# Altium schematic sheet Schematic.SchDoc
size A4
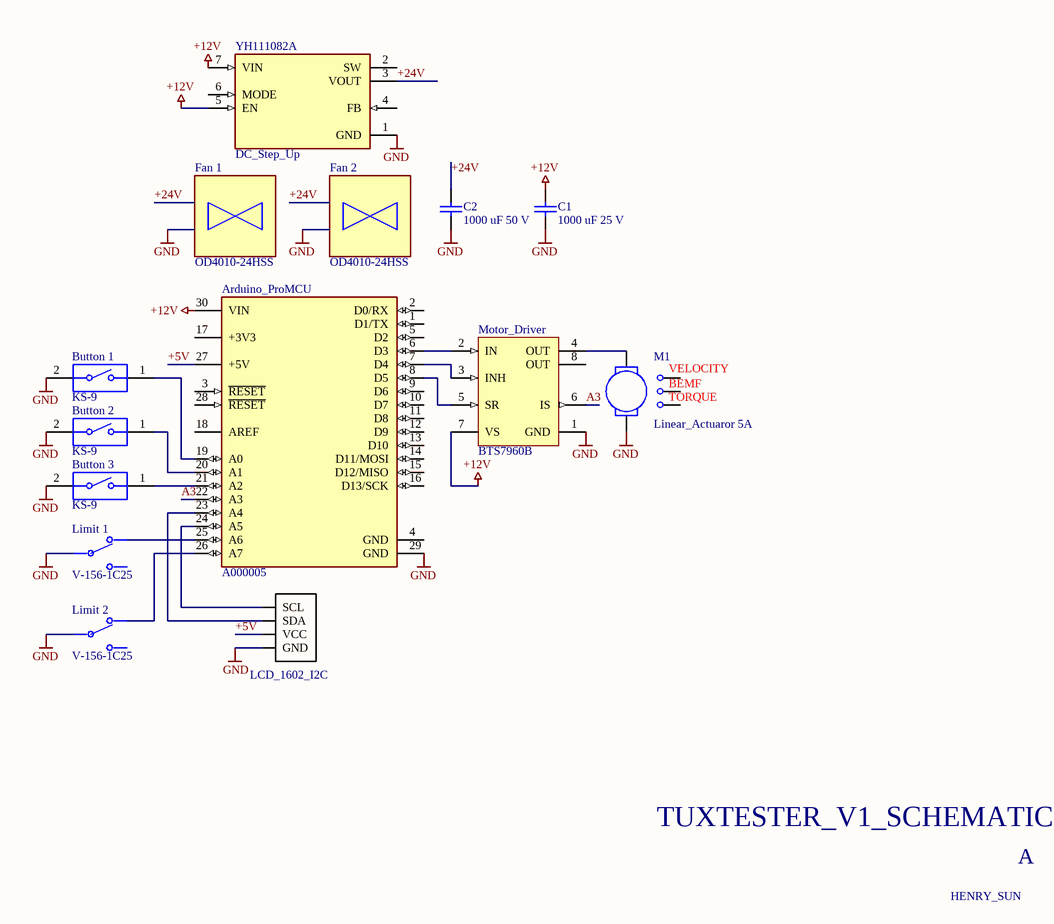
[diagram p0: Schematic.SchDoc]

## Parts
Arduino_ProMCU  A000005  [FP-A000005-MFG]
Button_1  KS-9  [CHRY-MX1A-11NN_V]
Button_2  KS-9  [CHRY-MX1A-11NN_V]
Button_3  KS-9  [CHRY-MX1A-11NN_V]
C1  value 1000 uF 25 V  (hidden comment: Capacitor)
C2  value 1000 uF 50 V  (hidden comment: Capacitor)
DC_Step_Up  YH111082A  [CONV_TPS61022RWUT]
Fan_1  OD4010-24HSS  [FP-PFB1224UHE-MFG]
Fan_2  OD4010-24HSS  [FP-PFB1224UHE-MFG]
LCD_1602_I2C  LCD1602  [LCD1602_I2CLCD1602_LCD1602(Primary)]  (value not drawn)
Limit_1  V-156-1C25  [FP-V-155-1A5-MFG]
Limit_2  V-156-1C25  [FP-V-155-1A5-MFG]
M1  Linear_Actuaror 5A
Motor_Driver  BTS7960B  [INF-P-TO-263-7-6_M]

## Nets
 GND: Arduino_ProMCU.29(GND) Button_1.2 Button_2.2 Button_3.2 C1.2 C2.2 DC_Step_Up.1(GND) LCD_1602_I2C.P$1(GND) M1.2 Motor_Driver.1(GND)  [also labelled GND]
+12V: Arduino_ProMCU.30(VIN) C1.1 DC_Step_Up.5(EN) DC_Step_Up.7(VIN) Motor_Driver.7(VS)
+5V: Arduino_ProMCU.27(+5V) LCD_1602_I2C.P$2(VCC)
+24V: C2.1 DC_Step_Up.3(VOUT)
A3: Arduino_ProMCU.22(A3) Motor_Driver.6(IS)
NetArduino_ProMCU_6: Arduino_ProMCU.6(D3) Motor_Driver.2(IN)
NetArduino_ProMCU_7: Arduino_ProMCU.7(D4) Motor_Driver.3(INH)
NetArduino_ProMCU_8: Arduino_ProMCU.8(D5) Motor_Driver.5(SR)
NetArduino_ProMCU_19: Arduino_ProMCU.19(A0) Button_1.1
NetArduino_ProMCU_20: Arduino_ProMCU.20(A1) Button_2.1
NetArduino_ProMCU_21: Arduino_ProMCU.21(A2) Button_3.1
NetArduino_ProMCU_23: Arduino_ProMCU.23(A4) LCD_1602_I2C.P$3(SDA)
NetArduino_ProMCU_24: Arduino_ProMCU.24(A5) LCD_1602_I2C.P$4(SCL)
NetM1_1: M1.1 Motor_Driver.4(OUT)

Not connected (* = marked no-connect by the designer): Arduino_ProMCU 1(D1/TX) 2(D0/RX) 3(~{RESET}) 4(GND) 5(D2) 9(D6) 10(D7) 11(D8) 12(D9) 13(D10) 14(D11/MOSI) 15(D12/MISO) 16(D13/SCK) 17(+3V3) 18(AREF) 25(A6) 26(A7) 28(~{RESET}); DC_Step_Up 2(SW) 4(FB) 6(MODE); M1 3 4 5; Motor_Driver 8(OUT)

## Notes on the sheet
- TUXTESTER_V1_SCHEMATIC
- A
- HENRY_SUN
- (in symbol DC Motor) VELOCITY; BEMF; TORQUE

## Library data of the parts
Arduino_ProMCU = CMP-189986-000002-1: ARDUINO NANO ATMEGA328 EVAL BRD; Number of Bits: 8; Evaluation Kit: Yes; Operating Supply Voltage: 12V; Interface: I2C; Data Bus Width: 8b; Core Architecture: AVR; Packaging: Bulk; Length: 7inch; Package Quantity: 50; Width: 5inch; REACH SVHC: No SVHC; Weight: 0.358383oz; Series: AVR® ATmega; Height: 0.25inch
Button_1-Button_3 = CMP-2000-06785-1: Keymodule MX, SPST, IP40, 12 V Max, 10 mA Max, -10 to 70 degC, 2-Pin THD, RoHS, Bulk; Part No: MX1A11NN; Manufacturer: Cherry; Body Orientation: Straight; Total Travel: 4.06mm; Actuator Style: Button; Minimum Insulation Resistance: 100MOhm; Maximum Current Rating: 0.01A; Maximum Contact Resistance: 200mOhm; Operating Force: 0.58N; Actuator Length: 3.6mm; Maximum DC Voltage Rating: 12V; Illumination Type: N/R; Row Spacing: 6.35mm; Switch Configuration: N.O.; Electrical Life: 50000000Cycles; Type: DesktopProfile; Operating Temperature: -10to70C; Actuator Material: N/A; Supplier: CherryElectrical; Packaging: N/A; Contact Plating: N/A; Terminal Type: PCPins; Mechanical Life: N/A; Package Description: 2-Pin Through Hole Switch, Body 15.6 x 15.6 mm; Package Reference: MX1A-11NN; ECCN: EAR99; RoHS: Unknown; Contact Material: Silver/Gold; Datasheet URL: http://www.cherry.de/PDF/EN_CHERRY_MX1A-1xxx.pdf; Datasheet Version: 02/2016; Family: MX; Number of Terminals: 2; IP Rating: N/A; Pole Throw Configuration: SPST; Terminal Pitch: 2.54mm; Dielectric Strength: N/A; Actuator Color: N/A; Manufacturer URL: http://cherryswitches.com/cn/; HTS: 8536509065; Maximum Power Rating: N/A; Illumination Color: N/R; Dimension: 15.6x15.6x15.2mm; Housing Material: N/A; Maximum AC Voltage Rating: 12V; Package URL: http://cherryamericas.com/wp-content/uploads/2014/12/mx_cat.pdf; Mounting Technology: ThroughHole; Mounting: ThroughHole; Operating Speed: N/A
C1 C2 = Capacitor: SimulationGenericComponent: True
DC_Step_Up = TPS61022RWUT: ÐŸÐ¾Ð²Ñ‹ÑˆÐ°ÑŽÑ‰Ð¸Ð¹ Ð¿Ñ€ÐµÐ¾Ð±Ñ€Ð°Ð·Ð¾Ð²Ð°Ñ‚ÐµÐ»ÑŒ 8 Ð ÑÐ¾ ÑÐ²ÐµÑ€Ñ…Ð½Ð¸Ð·ÐºÐ¸Ð¼ Ð²Ñ…Ð¾Ð´Ð½Ñ‹Ð¼ Ð½Ð°Ð¿Ñ€ÑÐ¶ÐµÐ½Ð¸ÐµÐ¼ 0,5 Ð’; MF: Texas Instruments; SnapEDA_Link: https://www.snapeda.com/parts/TPS61022RWUT/Texas+Instruments/view-part/?ref=snap; Package: VQFN-HR-7 Texas Instruments; Value: *; MP: TPS61022RWUT; Check_prices: https://www.snapeda.com/parts/TPS61022RWUT/Texas+Instruments/view-part/?ref=eda
Fan_1 Fan_2 = CMP-52428-000001-1: FAN AXIAL 120X38MM 24VDC WIRE
LCD_1602_I2C = LCD1602: BLUE LCD 1602 2x16 Character Mat; MF: kamami; SnapEDA_Link: https://www.snapeda.com/parts/LCD1602/Kaga/view-part/?ref=snap; Package: None; MP: LCD1602; Check_prices: https://www.snapeda.com/parts/LCD1602/Kaga/view-part/?ref=eda; Value: *
Limit_1 Limit_2 = CMP-08833-000161-1: SWITCH SNAP ACTION SPDT 15A 250V; Ratings: IP40; Differential Travel: 0.025inch; Switch Function: On-Mom; Mechanical Life: 50000000Cycles; Overtravel: 0.03inch; Operating Position: 0.815inch; Current Rating: 10A; Actuator Material: Stainless Steel; Voltage Rating (DC): 30V; Electrical Life: 100000Cycles; Pretravel: 0.063inch; Operating Force: 2.35N; Termination: Solder; Max Operating Temperature: 80°C; Mount: Chassis Mount; Length: 37.8mm; Package Quantity: 100; Voltage Rating (AC): 250V; Min Operating Temperature: -25°C; RoHS Compliant: Yes; Depth: 10.3mm; Throw Configuration: SPDT; Series: V; Max Current Rating: 15A; Packaging: Bulk; Max Voltage Rating (AC): 250V; Orientation: Straight; Max Voltage Rating (DC): 250V; Contact Material: Silver
M1 = DC Motor: LA: 1.5M; RA: 0.5; KE: 0.05; JM: 250U; BM: 0.1M; TL: 0; SimulationGenericComponent: True; KT: 0.05
Motor_Driver = CMP-1114-00025-1: High Current PN Half Bridge NovalithIC, -40 to 150 degC, P-TO-263-7-6; Manufacturer: Infineon; Iq (typ): 7 uA; Green: FALSE; ComponentLink1Description: Manufacturer URL; Halogen-free: FALSE; PackageDescription: 7-Pin Plastic Transistor Single Outline Package, 9.9 x 9.2 mm Body, 1.27 mm Pitch; ComponentLink2Description: Datasheet; ComponentLink3Description: Package Specification; ComponentLink1URL: http://www.infineon.com/; ComponentLink2URL: http://www.infineon.com/dgdl/BTS7960_Datasheet.pdf?folderId=db3a304412b407950112b408e8c90004&fileId=db3a304412b407950112b43945006d5d&location=en.Products.Automotive_ICs.Motor_Drivers__Automotive_.Integrated_High_Current_Motor_Drivers__NovalithIC____Trilith; ComponentLink3URL: http://www.infineon.com/dgdl/BTS7970B_Datasheet.pdf?folderId=db3a304412b407950112b408e8c90004&fileId=db3a304412b407950112b43949b36d61&sId=db3a30433d68e984013d7db637dc5e6a; PackageReference: P-TO-263-7-6; PackageVersion: May-06; Mounting Technology: Surface Mount; RevisionNote: Re-Activated Devices; PartNumber: BTS7960B; DatasheetVersion: Rev. 1.1